# Altium schematic sheet isg_cena_host_board_rev1_top.SchDoc
size C; SheetNumber: 1; SheetTotal: 9
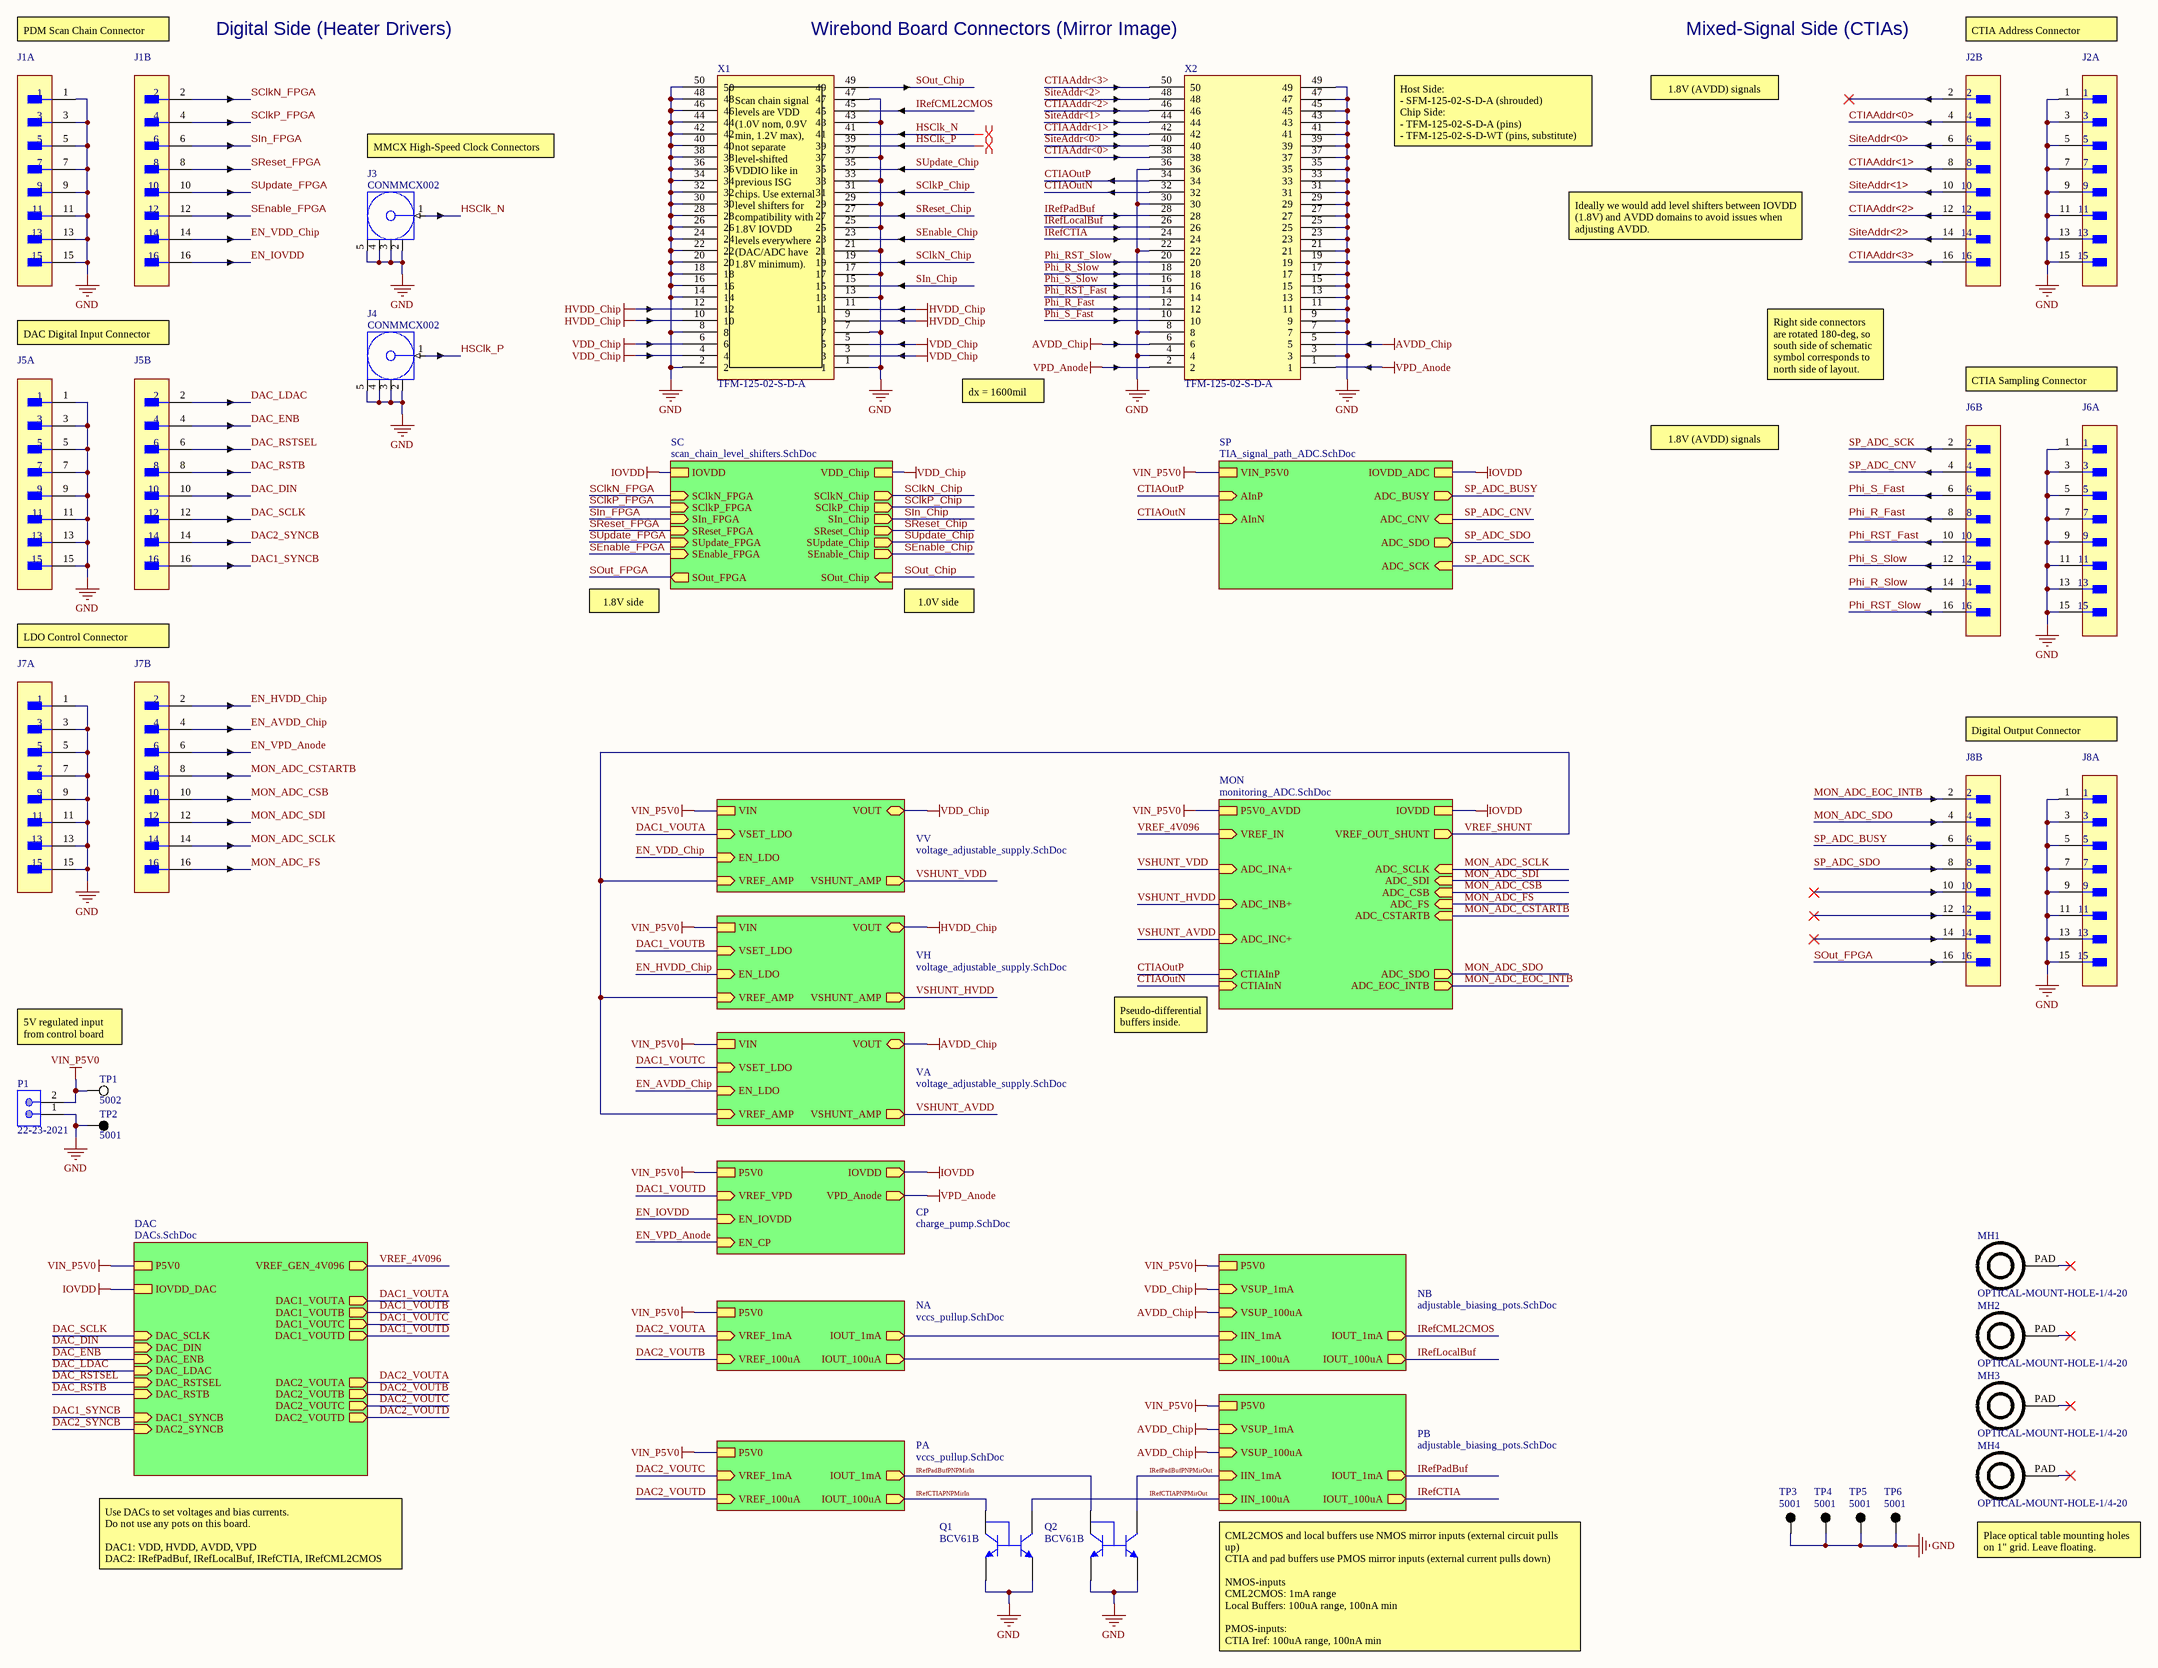
[diagram p0: isg_cena_host_board_rev1_top.SchDoc]

## Parts
J1  (no value)  [FP-FTSH-108-02-F-DV]  (parts A,B of 2)
J2  (no value)  [FP-FTSH-108-02-F-DV]  (parts A,B of 2)
J3  CONMMCX002  [CON-MMCX-RA]
J4  CONMMCX002  [CON-MMCX-RA]
J5  (no value)  [FP-FTSH-108-02-F-DV]  (parts A,B of 2)
J6  (no value)  [FP-FTSH-108-02-F-DV]  (parts A,B of 2)
J7  (no value)  [FP-FTSH-108-02-F-DV]  (parts A,B of 2)
J8  (no value)  [FP-FTSH-108-02-F-DV]  (parts A,B of 2)
MH1  OPTICAL-MOUNT-HOLE-1/4-20  [MH-1/4-20]
MH2  OPTICAL-MOUNT-HOLE-1/4-20  [MH-1/4-20]
MH3  OPTICAL-MOUNT-HOLE-1/4-20  [MH-1/4-20]
MH4  OPTICAL-MOUNT-HOLE-1/4-20  [MH-1/4-20]
P1  22-23-2021  [MOLX-22-23-2021_V]
Q1  BCV61B  [INF-SOT143-4-1_V]
Q2  BCV61B  [INF-SOT143-4-1_V]
TP1  5002  [KSTN-5002]
TP2  5001  [KSTN-5001]
TP3  5001  [KSTN-5001]
TP4  5001  [KSTN-5001]
TP5  5001  [KSTN-5001]
TP6  5001  [KSTN-5001]
X1  TFM-125-02-S-D-A  [SAMTEC-TFM-125-02-X-D-A]
X2  TFM-125-02-S-D-A  [SAMTEC-TFM-125-02-X-D-A]

## Sub-sheets
CP = charge_pump.SchDoc: P5V0, EN_CP (in), IOVDD (out), VPD_Anode (out), VREF_VPD (in), EN_IOVDD (in)
DAC = DACs.SchDoc: P5V0, IOVDD_DAC, DAC1_VOUTA (out), DAC1_VOUTB (out), DAC1_VOUTC (out), DAC1_VOUTD (out), DAC2_VOUTA (out), DAC2_VOUTB (out), DAC2_VOUTC (out), DAC2_VOUTD (out), DAC_SCLK (in), DAC_DIN (in), DAC1_SYNCB (in), DAC_ENB (in), DAC_LDAC (in), DAC_RSTSEL (in), DAC_RSTB (in), DAC2_SYNCB (in), VREF_GEN_4V096 (out)
MON = monitoring_ADC.SchDoc: P5V0_AVDD, IOVDD, ADC_INA+ (in), ADC_INB+ (in), ADC_INC+ (in), CTIAInP (in), CTIAInN (in), ADC_SCLK (in), ADC_SDI (in), ADC_SDO (out), ADC_CSB (in), ADC_FS (in), ADC_CSTARTB (in), ADC_EOC_INTB (out), VREF_IN (in), VREF_OUT_SHUNT (out)
NA = vccs_pullup.SchDoc: P5V0, VREF_1mA (in), VREF_100uA (in), IOUT_1mA (out), IOUT_100uA (out)
NB = adjustable_biasing_pots.SchDoc: VSUP_1mA (in), IIN_1mA (in), IIN_100uA (in), IOUT_1mA (out), IOUT_100uA (out), VSUP_100uA (in), P5V0
PA = vccs_pullup.SchDoc: P5V0, VREF_1mA (in), VREF_100uA (in), IOUT_1mA (out), IOUT_100uA (out)
PB = adjustable_biasing_pots.SchDoc: VSUP_1mA (in), IIN_1mA (in), IIN_100uA (in), IOUT_1mA (out), IOUT_100uA (out), VSUP_100uA (in), P5V0
SC = scan_chain_level_shifters.SchDoc: VDD_Chip, IOVDD, SClkN_FPGA (in), SClkP_FPGA (in), SIn_FPGA (in), SReset_FPGA (in), SUpdate_FPGA (in), SEnable_FPGA (in), SClkN_Chip (out), SClkP_Chip (out), SIn_Chip (out), SReset_Chip (out), SUpdate_Chip (out), SEnable_Chip (out), SOut_FPGA (out), SOut_Chip (in)
SP = TIA_signal_path_ADC.SchDoc: VIN_P5V0, AInP (in), AInN (in), IOVDD_ADC, ADC_BUSY (out), ADC_CNV (in), ADC_SDO (out), ADC_SCK (in)
VA = voltage_adjustable_supply.SchDoc: VIN, VOUT (bidir), VSET_LDO (in), EN_LDO (in), VSHUNT_AMP (out), VREF_AMP (in)
VH = voltage_adjustable_supply.SchDoc: VIN, VOUT (bidir), VSET_LDO (in), EN_LDO (in), VSHUNT_AMP (out), VREF_AMP (in)
VV = voltage_adjustable_supply.SchDoc: VIN, VOUT (bidir), VSET_LDO (in), EN_LDO (in), VSHUNT_AMP (out), VREF_AMP (in)

## Nets
AVDD_Chip: X2.5 X2.6 ; sheet VA/VOUT, sheet PB/VSUP_1mA, sheet PB/VSUP_100uA, sheet NB/VSUP_100uA
GND: J1.1 J1.3 J1.5 J1.7 J1.9 J1.11 J1.13 J1.15 J2.1 J2.3 J2.5 J2.7 J2.9 J2.11 J2.13 J2.15 J3.2(GND) J3.3(GND) J3.4(GND) J3.5(GND) J4.2(GND) J4.3(GND) J4.4(GND) J4.5(GND) J5.1 J5.3 J5.5 J5.7 J5.9 J5.11 J5.13 J5.15 J6.1 J6.3 J6.5 J6.7 J6.9 J6.11 J6.13 J6.15 J7.1 J7.3 J7.5 J7.7 J7.9 J7.11 J7.13 J7.15 J8.1 J8.3 J8.5 J8.7 J8.9 J8.11 J8.13 J8.15 P1.1 Q1.3(E1) Q1.4(E2) Q2.3(E1) Q2.4(E2) TP2.1 TP3.1 TP4.1 TP5.1 TP6.1 X1.1 X1.2 X1.7 X1.8 X1.13 X1.14 X1.16 X1.17 X1.18 X1.20 X1.21 X1.22 X1.24 X1.25 X1.26 X1.28 X1.29 X1.30 X1.32 X1.33 X1.34 X1.36 X1.37 X1.38 X1.40 X1.42 X1.43 X1.44 X1.46 X1.47 X1.48 X1.50 X2.3 X2.4 X2.7 X2.8 X2.9 X2.11 X2.13 X2.15 X2.17 X2.19 X2.21 X2.22 X2.23 X2.25 X2.27 X2.29 X2.30 X2.31 X2.33 X2.35 X2.36 X2.37 X2.39 X2.41 X2.43 X2.45 X2.47 X2.49
HVDD_Chip: X1.9 X1.10 X1.11 X1.12 ; sheet VH/VOUT
IOVDD: sheet CP/IOVDD, sheet DAC/IOVDD_DAC, sheet SP/IOVDD_ADC, sheet SC/IOVDD, sheet MON/IOVDD
VDD_Chip: X1.3 X1.4 X1.5 X1.6 ; sheet VV/VOUT, sheet NB/VSUP_1mA, sheet SC/VDD_Chip
VIN_P5V0: P1.2 TP1.1 ; sheet VV/VIN, sheet VH/VIN, sheet VA/VIN, sheet NA/P5V0, sheet PA/P5V0, sheet PB/P5V0, sheet NB/P5V0, sheet CP/P5V0, sheet DAC/P5V0, sheet SP/VIN_P5V0, sheet MON/P5V0_AVDD
VPD_Anode: X2.1 X2.2 ; sheet CP/VPD_Anode
CTIAAddr<0>: J2.4 X2.38
CTIAAddr<1>: J2.8 X2.42
CTIAAddr<2>: J2.12 X2.46
CTIAAddr<3>: J2.16 X2.50
CTIAOutN: X2.32 ; sheet SP/AInN, sheet MON/CTIAInN
CTIAOutP: X2.34 ; sheet SP/AInP, sheet MON/CTIAInP
DAC1_SYNCB: J5.16 ; sheet DAC/DAC1_SYNCB
DAC1_VOUTA: sheet VV/VSET_LDO, sheet DAC/DAC1_VOUTA
DAC1_VOUTB: sheet VH/VSET_LDO, sheet DAC/DAC1_VOUTB
DAC1_VOUTC: sheet VA/VSET_LDO, sheet DAC/DAC1_VOUTC
DAC1_VOUTD: sheet CP/VREF_VPD, sheet DAC/DAC1_VOUTD
DAC2_SYNCB: J5.14 ; sheet DAC/DAC2_SYNCB
DAC2_VOUTA: sheet NA/VREF_1mA, sheet DAC/DAC2_VOUTA
DAC2_VOUTB: sheet NA/VREF_100uA, sheet DAC/DAC2_VOUTB
DAC2_VOUTC: sheet PA/VREF_1mA, sheet DAC/DAC2_VOUTC
DAC2_VOUTD: sheet PA/VREF_100uA, sheet DAC/DAC2_VOUTD
DAC_DIN: J5.10 ; sheet DAC/DAC_DIN
DAC_ENB: J5.4 ; sheet DAC/DAC_ENB
DAC_LDAC: J5.2 ; sheet DAC/DAC_LDAC
DAC_RSTB: J5.8 ; sheet DAC/DAC_RSTB
DAC_RSTSEL: J5.6 ; sheet DAC/DAC_RSTSEL
DAC_SCLK: J5.12 ; sheet DAC/DAC_SCLK
EN_AVDD_Chip: J7.4 ; sheet VA/EN_LDO
EN_HVDD_Chip: J7.2 ; sheet VH/EN_LDO
EN_IOVDD: J1.16 ; sheet CP/EN_IOVDD
EN_VDD_Chip: J1.14 ; sheet VV/EN_LDO
EN_VPD_Anode: J7.6 ; sheet CP/EN_CP
HSClk_N: J3.1(Signal) X1.41
HSClk_P: J4.1(Signal) X1.39
IRefCML2CMOS: X1.45 ; sheet NB/IOUT_1mA
IRefCTIA: X2.24 ; sheet PB/IOUT_100uA
IRefCTIAPNPMirIn: Q1.1(C2) ; sheet PA/IOUT_100uA
IRefCTIAPNPMirOut: Q1.2(C1) ; sheet PB/IIN_100uA
IRefLocalBuf: X2.26 ; sheet NB/IOUT_100uA
IRefPadBuf: X2.28 ; sheet PB/IOUT_1mA
IRefPadBufPNPMirIn: Q2.1(C2) ; sheet PA/IOUT_1mA
IRefPadBufPNPMirOut: Q2.2(C1) ; sheet PB/IIN_1mA
MON_ADC_CSB: J7.10 ; sheet MON/ADC_CSB
MON_ADC_CSTARTB: J7.8 ; sheet MON/ADC_CSTARTB
MON_ADC_EOC_INTB: J8.2 ; sheet MON/ADC_EOC_INTB
MON_ADC_FS: J7.16 ; sheet MON/ADC_FS
MON_ADC_SCLK: J7.14 ; sheet MON/ADC_SCLK
MON_ADC_SDI: J7.12 ; sheet MON/ADC_SDI
MON_ADC_SDO: J8.4 ; sheet MON/ADC_SDO
Phi_R_Fast: J6.8 X2.12
Phi_R_Slow: J6.14 X2.18
Phi_RST_Fast: J6.10 X2.14
Phi_RST_Slow: J6.16 X2.20
Phi_S_Fast: J6.6 X2.10
Phi_S_Slow: J6.12 X2.16
SClkN_Chip: X1.19 ; sheet SC/SClkN_Chip
SClkN_FPGA: J1.2 ; sheet SC/SClkN_FPGA
SClkP_Chip: X1.31 ; sheet SC/SClkP_Chip
SClkP_FPGA: J1.4 ; sheet SC/SClkP_FPGA
SEnable_Chip: X1.23 ; sheet SC/SEnable_Chip
SEnable_FPGA: J1.12 ; sheet SC/SEnable_FPGA
SIn_Chip: X1.15 ; sheet SC/SIn_Chip
SIn_FPGA: J1.6 ; sheet SC/SIn_FPGA
SiteAddr<0>: J2.6 X2.40
SiteAddr<1>: J2.10 X2.44
SiteAddr<2>: J2.14 X2.48
SOut_Chip: X1.49 ; sheet SC/SOut_Chip
SOut_FPGA: J8.16 ; sheet SC/SOut_FPGA
SP_ADC_BUSY: J8.6 ; sheet SP/ADC_BUSY
SP_ADC_CNV: J6.4 ; sheet SP/ADC_CNV
SP_ADC_SCK: J6.2 ; sheet SP/ADC_SCK
SP_ADC_SDO: J8.8 ; sheet SP/ADC_SDO
SReset_Chip: X1.27 ; sheet SC/SReset_Chip
SReset_FPGA: J1.8 ; sheet SC/SReset_FPGA
SUpdate_Chip: X1.35 ; sheet SC/SUpdate_Chip
SUpdate_FPGA: J1.10 ; sheet SC/SUpdate_FPGA
VREF_4V096: sheet DAC/VREF_GEN_4V096, sheet MON/VREF_IN
VREF_SHUNT: sheet VV/VREF_AMP, sheet VH/VREF_AMP, sheet VA/VREF_AMP, sheet MON/VREF_OUT_SHUNT
VSHUNT_AVDD: sheet VA/VSHUNT_AMP, sheet MON/ADC_INC+
VSHUNT_HVDD: sheet VH/VSHUNT_AMP, sheet MON/ADC_INB+
VSHUNT_VDD: sheet VV/VSHUNT_AMP, sheet MON/ADC_INA+
(unnamed): sheet NA/IOUT_1mA, sheet NB/IIN_1mA
(unnamed): sheet NA/IOUT_100uA, sheet NB/IIN_100uA

Not connected (* = marked no-connect by the designer): J2 2*; J8 10* 12* 14*; MH1 PAD*; MH2 PAD*; MH3 PAD*; MH4 PAD*

## Layout directives
differential pair: HSClk_N, HSClk_P

## Notes on the sheet
- PDM Scan Chain Connector
- Digital Side (Heater Drivers)
- Wirebond Board Connectors (Mirror Image)
- Mixed-Signal Side (CTIAs)
- CTIA Address Connector
- 1.8V (AVDD) signals
- MMCX High-Speed Clock Connectors
- Host Side:
  - SFM-125-02-S-D-A (shrouded)
  Chip Side:
  - TFM-125-02-S-D-A (pins)
  - TFM-125-02-S-D-WT (pins, substitute)
- Ideally we would add level shifters between IOVDD (1.8V) and AVDD domains to avoid issues when adjusting AVDD.
- DAC Digital Input Connector
- (near X1) Scan chain signal levels are VDD (1.0V nom, 0.9V min, 1.2V max), not separate level-shifted VDDIO like in previous ISG chips. Use external level shifters for compatibility with 1.8V IOVDD levels everywhere (DAC/ADC have 1.8V minimum).
- Right side connectors are rotated 180-deg, so south side of schematic symbol corresponds to north side of layout.
- CTIA Sampling Connector
- dx = 1600mil
- 1.8V side
- 1.0V side
- LDO Control Connector
- Digital Output Connector
- Pseudo-differential buffers inside.
- 5V regulated input from control board
- Place optical table mounting holes on 1" grid. Leave floating.
- Use DACs to set voltages and bias currents.
  Do not use any pots on this board.
  DAC1: VDD, HVDD, AVDD, VPD
  DAC2: IRefPadBuf, IRefLocalBuf, IRefCTIA, IRefCML2CMOS
- CML2CMOS and local buffers use NMOS mirror inputs (external circuit pulls up)
  CTIA and pad buffers use PMOS mirror inputs (external current pulls down)
  NMOS-inputs
  CML2CMOS: 1mA range
  Local Buffers: 100uA range, 100nA min
  PMOS-inputs:
  CTIA Iref: 100uA range, 100nA min
  Pad Buffers: 1mA range

## Library data of the parts
J1 J2 J5-J8 = FP-FTSH-108-02-F-DV: CONN HEADER SMD 16POS 1.27MM; Manufacturer: Samtec; Standoff Height: 0.46mm; Conn Orientation: Vertical; Current Rating: 3.4A; Number Of Contacts: 16; Conn Gender: Male; Lead Free: Yes; Package: FTSH-108-02-F-DV; Footprint Url: http://suddendocs.samtec.com/prints/ftsh-1xx-xx-xxx-dv-xxx-footprint.pdf; Automotive: No; Pitch: 1.27mm; Manufacturer Part Number: FTSH-108-02-F-DV; Device Class L2: Headers and Wire Housings; ComponentLink2URL: http://suddendocs.samtec.com/prints/ftsh-1xx-xx-xxx-dv-xxx-xxx-mkt.pdf; ComponentLink2Description: Datasheet; Octopart: https://octopart.com/ftsh-108-02-f-dv-samtec-10605893; RoHS: TRUE; Digikey Description: CONN HEADER SMD 16POS 1.27MM; Device Class L1: Connectors; Temperature Range High: +125°C; Temperature: -55°C to +125°C; Device Class L3: unset; Category: Conn; Temperature Range Low: -55°C; Number Of Rows: 2; Contact Material: Gold,Nickel; Mouser Description: Conn Unshrouded Header HDR 16 POS 1.27mm Solder ST SMD Tube; Height: 5.09mm
J3 J4 = CMP-0168-00017-1: MMCX Female Right Angle PCB Mount Connector, Thru-Hole; PCB_Layout: Pads complies with manufacturer's recommendation.; PackageVersion: rev1.0, Jun-2007; PackageDescription: MMCX Female Right Angle PCB Mount Connector, Thru-Hole, 3.45 x 3.45 mm Body; DatasheetVersion: rev1.0, Jun-2007; PackageReference: CON-MMCX-RA
P1 = CMP-1704-00001-3: Male Header, Pitch 2.54 mm, 1 x 2 Position, Height 10.67 mm, Tail Length 3.56 mm, 0 to 75 degC, RoHS, Bulk; Package Quantity: 3000; Height: 10.67 mm; RoHSCompliant: True; ComponentLink2URL: https://datasheet.ciiva.com/19454/232266-19454304.pdf; PartNumber: 22-23-2021; Packaging: Bulk; ComponentLink2Description: Datasheet; Min Operating Temperature: 0 degC; ComponentLink1Description: Manufacturer URL; Length: 5.08 mm; Mounting Technology: Through Hole; Max Operating Temperature: 75 degC; REACH SVHC: Unknown; PackageDescription: Male Header, Pitch 2.54 mm, 1 x 2 Position, Height 10.67 mm, Tail Length 3.56 mm; ComponentLink1URL: http://www.molex.com/; Mount: Through Hole; Radiation Hardening: No; Width: 6.35 mm; Pins: 2
Q1 Q2 = CMP-1190-00001-1: NPN Silicon Double Transistor, 30 V VCEO, 100 mA IC, SOT143-4-1, Reel, Green; Manufacturer: Infineon; VCEO (max): 30Â V; Ptot (max): 300 mW; Green: TRUE; ICBO (max): 15Â nA; IC (max): 100 mA; IC: 2 mA; VCE (max): 5Â V; VEBO (max): 6Â V; ICM (max): 200Â mA; fT (typ): 250Â MHz; Polarity: NPN; PartNumber: BCV61B; ComponentLink1Description: Manufacturer URL; PackageDescription: 4-Pin Small Outline Transistor Package, 1.3 x 2.9 mm Body; ComponentLink1URL: http://www.infineon.com/; ComponentLink2Description: Datasheet; Mounting Technology: Surface Mount; ComponentLink3URL: http://www.infineon.com/dgdl/SOT143-Package_Overview.pdf?folderId=db3a30431936bc4b011952ce8b1b3bed&fileId=db3a30431936bc4b011952df42203c0c; Packing: Reel; VCBO (max): 30Â V; ComponentLink2URL: http://www.infineon.com/dgdl/bcv61.pdf?folderId=db3a30431441fb5d0114498f7eab01ce&fileId=db3a30431441fb5d011449d8ff720246; PackageReference: SOT143-4-1; VCE: 5Â V; ComponentLink3Description: Package Specification
TP1 = CMP-2000-05182-1: Test Point, White, 1-Pin THD, RoHS, Bulk; Manufacturer: KeystoneElectronics; Outside Diameter: 2.54mm; Plating: Silver; Mounting Hole Size: 1mm; Product: TestPoints; Packaging: Bulk; Manufacturer URL: http://www.keyelco.com/; Length: 7.62mm; Datasheet Version: Rev. G, 12/2008; Type: Miniature; Product Category: CircuitBoardHardware-PCB; Material: Nylon; RoHS: True; Contact Material: PhosphorBronze; Datasheet URL: https://ciiva.com/datasheet-click-2917627?src=ciiva&sig=bd195616; Color: White; Brand: KeystoneElectronics
TP2-TP6 = CMP-2000-05181-1: Test Point, Black, 1-Pin THD, RoHS, Bulk; Manufacturer: Keystone; Other Names: 5001K; Catalog Drawings: 5000Series; Alternate Color: 5004K-ND / -TESTPOINTPCMINI.040"DYELLOW / 5003K-ND / -TESTPOINTPCMINI.040"DORANGE / 5002K-ND / -TESTPOINTPCMINI.040"DWHITE / 5000K-ND / -TESTPOINTPCMINI.040"DRED; Kits: DKTGRS232C-KIT-ND / -TTLCONVERTER; Online Catalog: ColorCodedTestPoints; Datasheet URL: https://ciiva.com/datasheet-click-2917627?src=ciiva&sig=bd195616; Mounting Type: 0.040"(1.02mm)HoleDiameter; Family: TestPoints; RoHS Information: RoHSComplianceStatement; Datasheet Version: Rev. G, 12/2008; Color: Black; Category: TestandMeasurement; Standard Package: 100; Manufacturer URL: http://www.keyelco.com/; Material: Base,Nylon46,UL94V-0; Type: PCTestPoint,Miniature; Terminal: 0.010"x0.020"(0.25mmx0.51mm)PhosphorBronzeWire,SilverPlated; Series: THM; Packaging: Bulk
X1 X2 = TFM-125-02-X-D-A: SAMTEC TFM-125-02-X-D-A